# Altium schematic sheet WT2_Screen.SchDoc
size A4
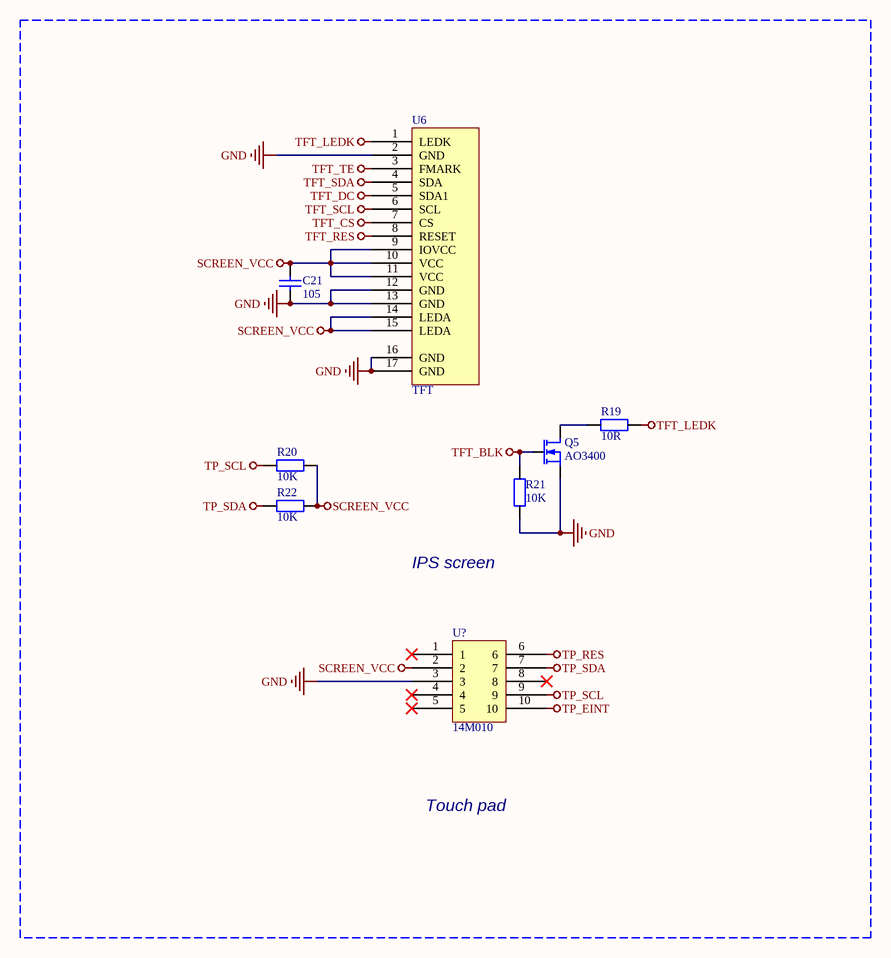
[diagram p0: WT2_Screen.SchDoc]

## Parts
C21  105  [电容_C0603]
Q5  AO3400  [MOS_SOT-23]
R19  10R  [电阻_R0402]
R20  10K  [电阻_R0402]
R21  10K  [电阻_R0402]
R22  10K  [电阻_R0402]
U6  TFT  [FPC-0.30mm-15P]
U?  14M010  [OK-14F010 10PIN]

## Nets
GND: C21.2 Q5.3(S) R21.1 U6.2(GND) U6.12(GND) U6.13(GND) U6.16(GND) U6.17(GND) U?.3
SCREEN_VCC: C21.1 R20.1 R22.1 U6.9(IOVCC) U6.10(VCC) U6.11(VCC) U6.14(LEDA) U6.15(LEDA) U?.2
TFT_BLK: Q5.1(G) R21.2
TFT_CS: U6.7(CS)
TFT_DC: U6.5(SDA1)
TFT_LEDK: R19.2 U6.1(LEDK)
TFT_RES: U6.8(RESET)
TFT_SCL: U6.6(SCL)
TFT_SDA: U6.4(SDA)
TFT_TE: U6.3(FMARK)
TP_EINT: U?.10
TP_RES: U?.6
TP_SCL: R20.2 U?.9
TP_SDA: R22.2 U?.7
NetQ5_2: Q5.2(D) R19.1

Not connected (* = marked no-connect by the designer): U? 1* 4* 5* 8*

## Notes on the sheet
- IPS screen
- Touch pad

## Library data of the parts
C21 = cap: U: 50V; 参数: Cap,0805,X7R,104K,50V,125C,±10%; C: 105
Q5 = MOSFET-N: _Comma: ,; _Current: 150A; _Footprint: DFN5*6; _Name: N-MOSFET; _Specification: N-MOSFET,AO3400,DFN5*6,150A,30V; _Voltage: 30V; _Model: AO3400
R19 = Res: _Accuracy: 1%; _Power: 1/8W; _Footprint: 0805; _Drift: 100ppm; _Comma: ,; _Specification: Res,0805,10R,1%,1/8W,100ppm; _Name: Res; _Value: 10R
R20-R22 = Res: _Accuracy: 1%; _Power: 1/8W; _Footprint: 0805; _Drift: 100ppm; _Comma: ,; _Specification: Res,0805,10K,1%,1/8W,100ppm; _Name: Res; _Value: 10K
U6 = TFT_IPS1-1.54寸240*240-AML015410V1: IPS电容式触摸屏
U? = OK-14M010-04: 奇亚板对板连接器